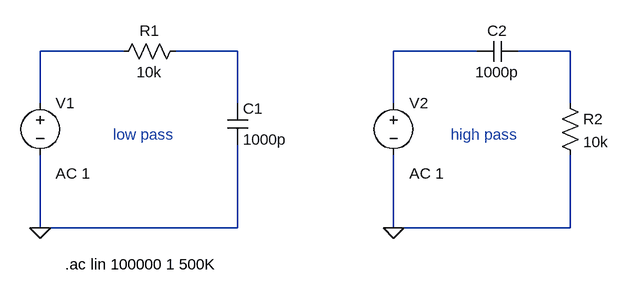
[diagram p0: schematic low-pass-filter.asc]
low-pass-filter.asc, the LTspice schematic file:
Version 4
SHEET 1 880 680
WIRE 16 112 -112 112
WIRE 192 112 96 112
WIRE 560 112 432 112
WIRE 704 112 624 112
WIRE -112 192 -112 112
WIRE 192 192 192 112
WIRE 432 192 432 112
WIRE 704 192 704 112
WIRE -112 384 -112 272
WIRE 192 384 192 256
WIRE 192 384 -112 384
WIRE 432 384 432 272
WIRE 704 384 704 272
WIRE 704 384 432 384
FLAG -112 384 0
FLAG 432 384 0
SYMBOL voltage -112 176 R0
WINDOW 123 24 124 Left 2
WINDOW 39 0 0 Left 0
SYMATTR InstName V1
SYMATTR Value ""
SYMATTR Value2 AC 1
SYMBOL res 112 96 R90
WINDOW 0 0 56 VBottom 2
WINDOW 3 32 56 VTop 2
SYMATTR InstName R1
SYMATTR Value 10k
SYMBOL cap 176 192 R0
SYMATTR InstName C1
SYMATTR Value 1000p
SYMBOL voltage 432 176 R0
WINDOW 123 24 124 Left 2
WINDOW 39 0 0 Left 0
SYMATTR InstName V2
SYMATTR Value ""
SYMATTR Value2 AC 1
SYMBOL res 688 176 R0
SYMATTR InstName R2
SYMATTR Value 10k
SYMBOL cap 624 96 R90
WINDOW 0 0 32 VBottom 2
WINDOW 3 32 32 VTop 2
SYMATTR InstName C2
SYMATTR Value 1000p
TEXT -74 440 Left 2 !.ac lin 100000 1 500K
TEXT 0 240 Left 2 ;low pass
TEXT 520 240 Left 2 ;high pass

The netlist it stands for:
* low-pass-filter.asc
V1 N001 0 AC 1
R1 N002 N001 10k
C1 N002 0 1000p
V2 N003 0 AC 1
R2 N004 0 10k
C2 N004 N003 1000p
.ac lin 100000 1 500K
* low pass
* high pass
.backanno
.end